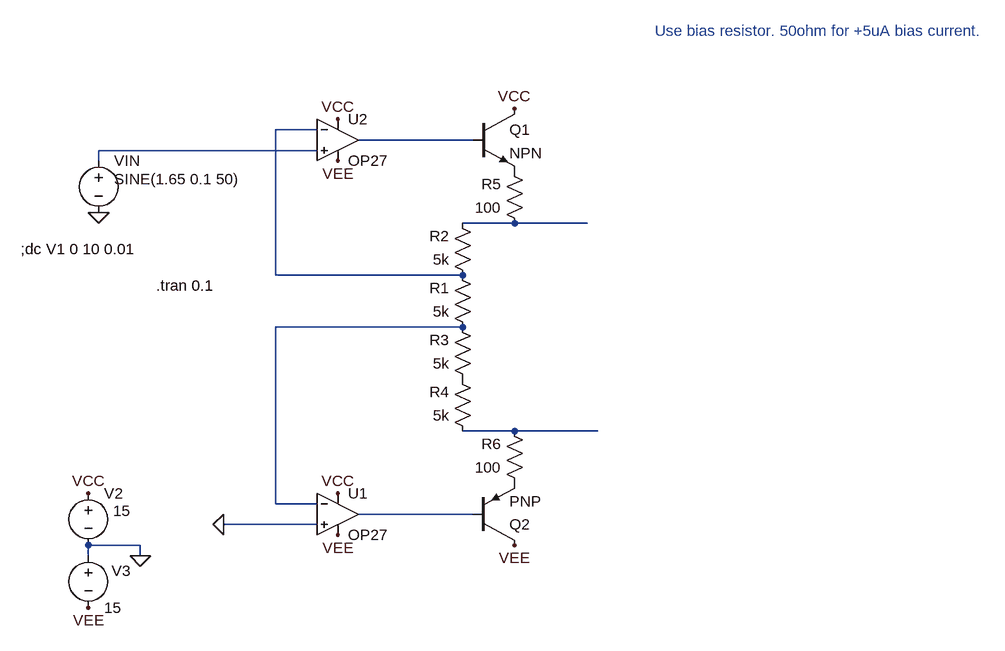
[diagram p0: schematic Draft32.asc]
Draft32.asc, the LTspice schematic file:
Version 4
SHEET 1 1452 940
WIRE 384 80 320 80
WIRE 624 96 448 96
WIRE 384 112 48 112
WIRE 48 128 48 112
WIRE 688 224 608 224
WIRE 800 224 688 224
WIRE 320 304 320 80
WIRE 608 304 320 304
WIRE 608 384 320 384
WIRE 688 544 608 544
WIRE 816 544 688 544
WIRE 320 656 320 384
WIRE 384 656 320 656
WIRE 624 672 448 672
WIRE 384 688 240 688
WIRE 112 720 32 720
WIRE 32 736 32 720
WIRE 112 736 112 720
FLAG 48 208 0
FLAG 112 736 0
FLAG 32 640 VCC
FLAG 416 64 VCC
FLAG 32 816 VEE
FLAG 416 128 VEE
FLAG 416 640 VCC
FLAG 416 704 VEE
FLAG 240 688 0
FLAG 688 48 VCC
FLAG 688 720 VEE
SYMBOL voltage 48 112 R0
WINDOW 123 0 0 Left 0
WINDOW 39 0 0 Left 0
WINDOW 3 24 44 Left 2
SYMATTR Value SINE(1.65 0.1 50)
SYMATTR InstName VIN
SYMBOL voltage 32 624 R0
WINDOW 123 0 0 Left 0
WINDOW 39 0 0 Left 0
WINDOW 3 38 43 Left 2
SYMATTR Value 15
SYMATTR InstName V2
SYMBOL voltage 32 720 R0
WINDOW 123 0 0 Left 0
WINDOW 39 0 0 Left 0
WINDOW 0 36 39 Left 2
SYMATTR InstName V3
SYMATTR Value 15
SYMBOL res 624 320 R180
WINDOW 0 36 76 Left 2
WINDOW 3 36 40 Left 2
SYMATTR InstName R2
SYMATTR Value 5k
SYMBOL res 624 480 R180
WINDOW 0 36 76 Left 2
WINDOW 3 36 40 Left 2
SYMATTR InstName R3
SYMATTR Value 5k
SYMBOL OpAmps\\OP27 416 32 R0
SYMATTR InstName U2
SYMBOL OpAmps\\OP27 416 608 R0
SYMATTR InstName U1
SYMBOL res 624 400 R180
WINDOW 0 36 76 Left 2
WINDOW 3 36 40 Left 2
SYMATTR InstName R1
SYMATTR Value 5k
SYMBOL res 624 560 R180
WINDOW 0 36 76 Left 2
WINDOW 3 36 40 Left 2
SYMATTR InstName R4
SYMATTR Value 5k
SYMBOL npn 624 48 R0
SYMATTR InstName Q1
SYMBOL res 704 240 R180
WINDOW 0 36 76 Left 2
WINDOW 3 36 40 Left 2
SYMATTR InstName R5
SYMATTR Value 100
SYMBOL pnp 624 720 M180
SYMATTR InstName Q2
SYMBOL res 704 640 R180
WINDOW 0 36 76 Left 2
WINDOW 3 36 40 Left 2
SYMATTR InstName R6
SYMATTR Value 100
TEXT -72 264 Left 2 !;dc V1 0 10 0.01
TEXT 136 320 Left 2 !.tran 0.1
TEXT 904 -72 Left 2 ;Use bias resistor. 50ohm for +5uA bias current.

The netlist it stands for:
* Draft32.asc
VIN N003 0 SINE(1.65 0.1 50)
V2 VCC 0 15
V3 0 VEE 15
R2 N001 N004 5k
R3 P001 N005 5k
XU2 N003 N001 VCC VEE N002 OP27  ; pins In+ In- V+ V- OUT
XU1 0 N005 VCC VEE N007 OP27  ; pins In+ In- V+ V- OUT
R1 N005 N001 5k
R4 N006 P001 5k
Q1 VCC N002 P002 0 NPN
R5 N004 P002 100
Q2 VEE N007 P003 0 PNP
R6 P003 N006 100
.model NPN NPN
.model PNP PNP
.lib standard.bjt
;dc V1 0 10 0.01
.tran 0.1
* Use bias resistor. 50ohm for +5uA bias current.
.lib ADI.lib
.backanno
.end